# Altium project 2CH_PM_Simulator.PrjPCB (part 3 of 3)

## Sheet SPI_MUX.SchDoc: Title
size 420 x 297 mm; Author: G.Kasprowicz; CompanyName: WUT ISE; DrawnBy: G.Kasprowicz; Organization: WUT ISE; Address1: PW ISE; Address2: Nowowiejska 15/19 00-665 Warsaw; Address3: gkasprow@gmail.com; Revision: 2; SheetNumber: -; SheetTotal: -; ModifiedBy: -; CheckedDate: -; Title2: Title 2; DivGrp: WUT ISE; Designer: G.Kasprowicz; ModifiedDate: -; ProjectName: Sensor Box
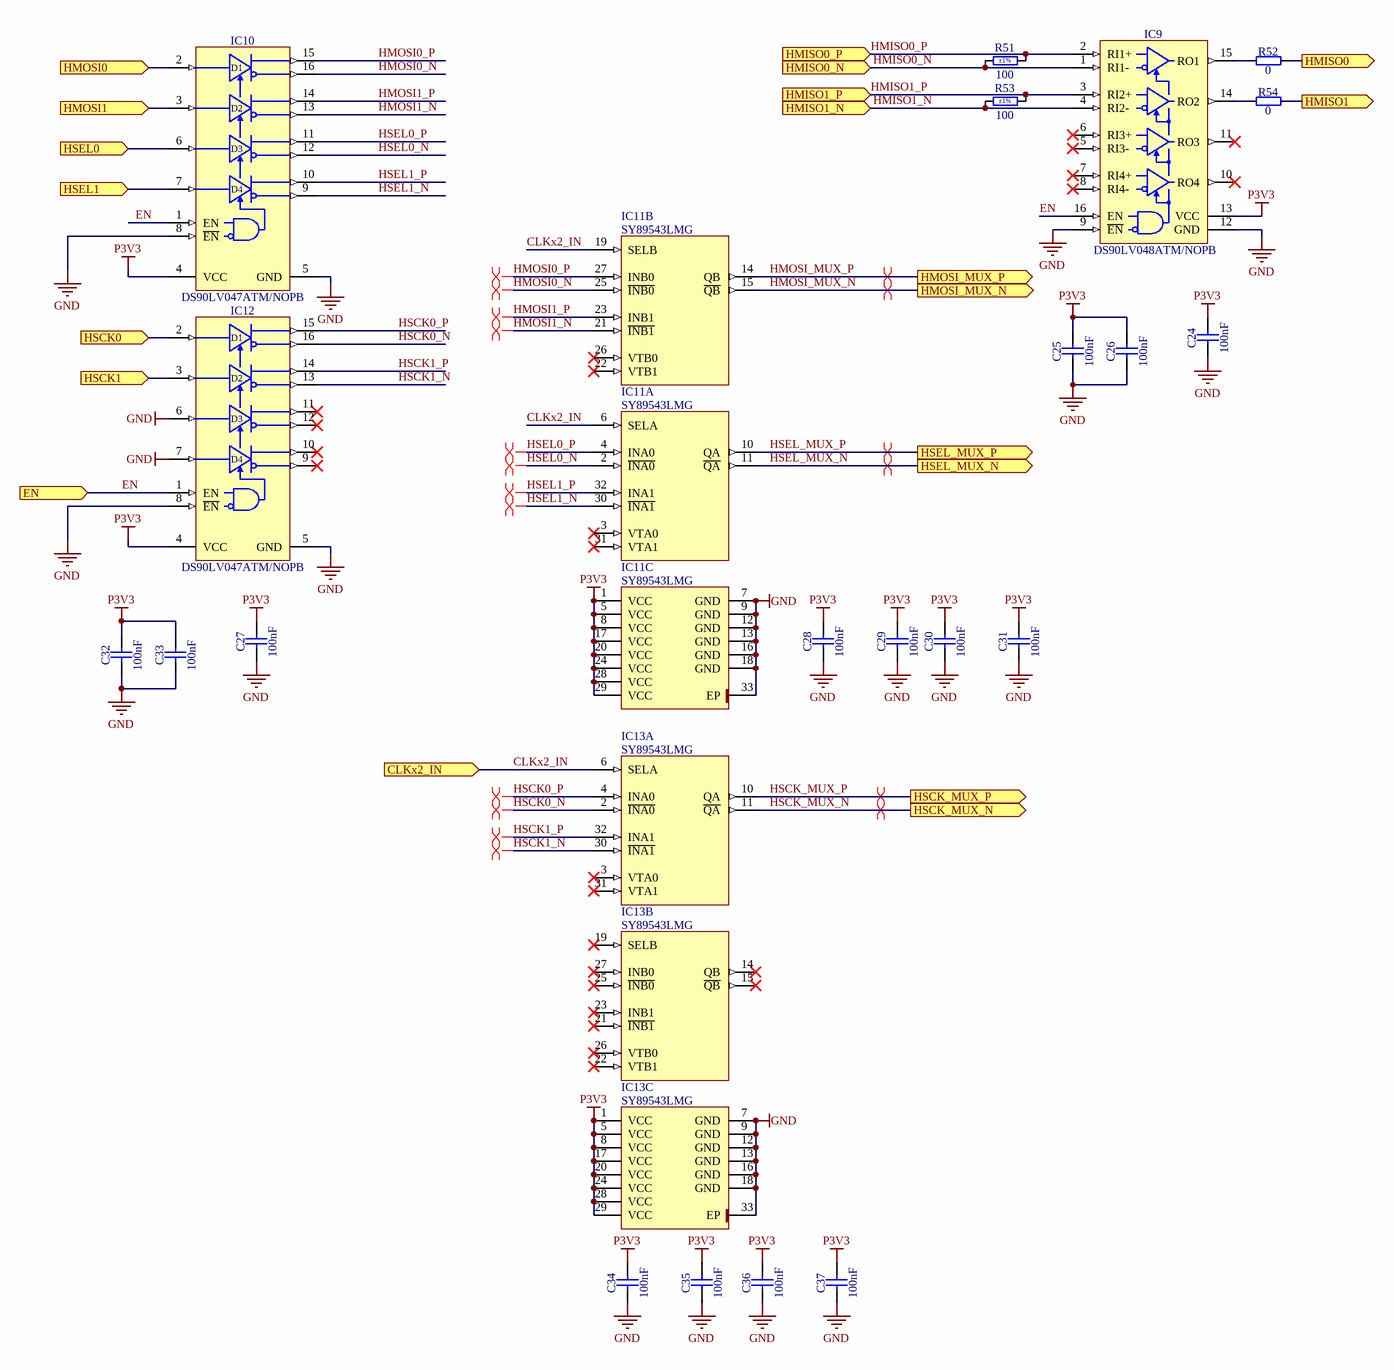
[diagram p6: SPI_MUX.SchDoc]

### Parts
C24  100nF  [CAPC1005X55N]
C25  100nF  [CAPC1005X55N]
C26  100nF  [CAPC1005X55N]
C27  100nF  [CAPC1005X55N]
C28  100nF  [CAPC1005X55N]
C29  100nF  [CAPC1005X55N]
C30  100nF  [CAPC1005X55N]
C31  100nF  [CAPC1005X55N]
C32  100nF  [CAPC1005X55N]
C33  100nF  [CAPC1005X55N]
C34  100nF  [CAPC1005X55N]
C35  100nF  [CAPC1005X55N]
C36  100nF  [CAPC1005X55N]
C37  100nF  [CAPC1005X55N]
IC9  DS90LV048ATM/NOPB  [SOIC127P600X175-16N]
IC10  DS90LV047ATM/NOPB  [SOIC127P600X175-16N]
IC11  SY89543LMG  [QFN50P500X500X90-33N-S320]  (parts A,B,C of 3)
IC12  DS90LV047ATM/NOPB  [SOIC127P600X175-16N]
IC13  SY89543LMG  [QFN50P500X500X90-33N-S320]  (parts A,B,C of 3)
R51  100  Tolerance: ±1%  [RESC1005X40N]
R52  0  [RESC1005X40N]
R53  100  Tolerance: ±1%  [RESC1005X40N]
R54  0  [RESC1005X40N]

### Ports
CLKx2_IN (in), EN (in), HMISO0 (out), HMISO0_N (in), HMISO0_P (in), HMISO1 (out), HMISO1_N (in), HMISO1_P (in), HMOSI0 (in), HMOSI1 (in), HMOSI_MUX_N (out), HMOSI_MUX_P (out), HSCK0 (in), HSCK1 (in), HSCK_MUX_N (out), HSCK_MUX_P (out), HSEL0 (in), HSEL1 (in), HSEL_MUX_N (out), HSEL_MUX_P (out)

### Nets
GND: C24.1 C25.1 C26.1 C27.1 C28.1 C29.1 C30.1 C31.1 C32.1 C33.1 C34.1 C35.1 C36.1 C37.1 IC9.9(~{EN}) IC9.12(GND) IC10.5(GND) IC10.8(~{EN}) IC11.7(GND) IC11.9(GND) IC11.12(GND) IC11.13(GND) IC11.16(GND) IC11.18(GND) IC11.33(EP) IC12.5(GND) IC12.6(DIN3) IC12.7(DIN4) IC12.8(~{EN}) IC13.7(GND) IC13.9(GND) IC13.12(GND) IC13.13(GND) IC13.16(GND) IC13.18(GND) IC13.33(EP)
P3V3: C24.2 C25.2 C26.2 C27.2 C28.2 C29.2 C30.2 C31.2 C32.2 C33.2 C34.2 C35.2 C36.2 C37.2 IC9.13(VCC) IC10.4(VCC) IC11.1(VCC) IC11.5(VCC) IC11.8(VCC) IC11.17(VCC) IC11.20(VCC) IC11.24(VCC) IC11.28(VCC) IC11.29(VCC) IC12.4(VCC) IC13.1(VCC) IC13.5(VCC) IC13.8(VCC) IC13.17(VCC) IC13.20(VCC) IC13.24(VCC) IC13.28(VCC) IC13.29(VCC)
CLKx2_IN: IC11.6(SELA) IC11.19(SELB) IC13.6(SELA) ; port CLKx2_IN
EN: IC9.16(EN) IC10.1(EN) IC12.1(EN) ; port EN
HMISO: R52.2 ; port HMISO0
HMISO: R54.2 ; port HMISO1  [a separate net that carries the same name]
HMISO0_N: IC9.1(RI1-) R51.1 ; port HMISO0_N  [project net EEM_IO.LVDS_N13]
HMISO0_P: IC9.2(RI1+) R51.2 ; port HMISO0_P  [project net EEM_IO.LVDS_P13]
HMISO1_N: IC9.4(RI2-) R53.1 ; port HMISO1_N  [project net EEM_IO.LVDS_N14]
HMISO1_P: IC9.3(RI2+) R53.2 ; port HMISO1_P  [project net EEM_IO.LVDS_P14]
HMOSI: IC10.2(DIN1) ; port HMOSI0
HMOSI: IC10.3(DIN2) ; port HMOSI1  [a separate net that carries the same name]
HMOSI0_N: IC10.16(DOUT1-) IC11.25(~{INB0})
HMOSI0_P: IC10.15(DOUT1+) IC11.27(INB0)
HMOSI1_N: IC10.13(DOUT2-) IC11.21(~{INB1})
HMOSI1_P: IC10.14(DOUT2+) IC11.23(INB1)
HMOSI_MUX_N: IC11.15(~{QB}) ; port HMOSI_MUX_N  [project net EEM_IO.LVDS_N6]
HMOSI_MUX_P: IC11.14(QB) ; port HMOSI_MUX_P  [project net EEM_IO.LVDS_P6]
HSCK: IC12.2(DIN1) ; port HSCK0
HSCK: IC12.3(DIN2) ; port HSCK1  [a separate net that carries the same name]
HSCK0_N: IC12.16(DOUT1-) IC13.2(~{INA0})
HSCK0_P: IC12.15(DOUT1+) IC13.4(INA0)
HSCK1_N: IC12.13(DOUT2-) IC13.30(~{INA1})
HSCK1_P: IC12.14(DOUT2+) IC13.32(INA1)
HSCK_MUX_N: IC13.11(~{QA}) ; port HSCK_MUX_N  [project net EEM_IO.LVDS_N5]
HSCK_MUX_P: IC13.10(QA) ; port HSCK_MUX_P  [project net EEM_IO.LVDS_P5]
HSEL: IC10.6(DIN3) ; port HSEL0
HSEL: IC10.7(DIN4) ; port HSEL1  [a separate net that carries the same name]
HSEL0_N: IC10.12(DOUT3-) IC11.2(~{INA0})
HSEL0_P: IC10.11(DOUT3+) IC11.4(INA0)
HSEL1_N: IC10.9(DOUT4-) IC11.30(~{INA1})
HSEL1_P: IC10.10(DOUT4+) IC11.32(INA1)
HSEL_MUX_N: IC11.11(~{QA}) ; port HSEL_MUX_N  [project net EEM_IO.LVDS_N7]
HSEL_MUX_P: IC11.10(QA) ; port HSEL_MUX_P  [project net EEM_IO.LVDS_P7]
NetIC9_14: IC9.14(RO2) R54.1
NetIC9_15: IC9.15(RO1) R52.1

Not connected (* = marked no-connect by the designer): IC9 5(RI3-)* 6(RI3+)* 7(RI4+)* 8(RI4-)* 10(RO4)* 11(RO3)*; IC11 3(VTA0)* 22(VTB1)* 26(VTB0)* 31(VTA1)*; IC12 9(DOUT4-)* 10(DOUT4+)* 11(DOUT3+)* 12(DOUT3-)*; IC13 3(VTA0)* 14(QB)* 15(~{QB})* 19(SELB)* 21(~{INB1})* 22(VTB1)* 23(INB1)* 25(~{INB0})* 26(VTB0)* 27(INB0)* 31(VTA1)*

### Layout directives
differential pair: EEM_IO.LVDS_N5, EEM_IO.LVDS_N6, EEM_IO.LVDS_N7, EEM_IO.LVDS_P5, EEM_IO.LVDS_P6, EEM_IO.LVDS_P7, HMOSI0_N, HMOSI0_P, HMOSI1_N, HMOSI1_P, HSCK0_N, HSCK0_P, HSCK1_N, HSCK1_P, HSEL0_N, HSEL0_P, HSEL1_N, HSEL1_P

### Notes on the sheet
- Project/Equipment
- Document
- Designer
- Drawn by
- Check.by
- Copyright WUT ISE 2024.
  This documentation describes Open Hardware and is licensed under the CERN OHL v.2. You may redistribute and modify this documentation under the terms of the CERN OHL v.2. (http://ohwr.org/CERNOHL). This documentation is distributed WITHOUT ANY EXPRESS OR IMPLIED WARRANTY, INCLUDING OF MERCHANTABILITY, SATISFACTORY QUALITY AND FITNESS FOR A PARTICULAR PURPOSE. Please see the CERN OHL v.2 for applicable conditions.
- Contact
- File
- Last Mod.
- Print Date
- Sheet
- Size
- A3
- of
- Rev
- (in symbol DS90LV047ATM/NOPB) D1; D2; D3; D4

### Library data of the parts
C24-C37 = CC0402_100NF_50V_10%_X7R: Non-polarised capacitor; Part Description: SMD Multilayer Chip Ceramic Capacitor; Manufacturer: GENERIC; Manufacturer1 Part Number: GRM155R71H104KE14D; Voltage: 50V; TC: X7R; Tolerance: ±10%; Part Number: CC0402_100NF_50V_10%_X7R; Component Kind: Standard; Component Type: Standard; Pin Count: 2; Value: 100nF; Status: None; Manufacturer Part Number: CC0402_100NF_50V_10%_X7R; Case: 0402; Mounted: Yes; Socket: No; SMD: Yes; Sense: No; Manufacturer1 Example: MURATA; Manufacturer1 ComponentHeight: 0.55mm; HelpURL: \\cern.ch\dfs\Applications\Altium\Datasheets\CC0402_MURATA_GRM155R71H104KE14D.pdf; Author: CERN DEM MR; CreateDate: 30.06.2017; LatestRevisionDate: 30.06.2017
IC9 = DS90LV048ATM/NOPB: 3V LVDS Quad CMOS Differential Line Receiver; Manufacturer: TEXAS INSTRUMENTS; PressFit: No; Bonding: No; Part Number: DS90LV048ATM/NOPB; Component Kind: Standard; Component Type: Standard; Device: DS90LV048ATM/NOPB; PackageDescription: SOIC 16, Pitch 1.27mm - Body 4x10mm, IPC Medium Density; Part Description: 3V LVDS Quad CMOS Differential Line Receiver; Manufacturer Part Number: DS90LV048ATM; Pin Count: 16; Case: SOIC16; Mounted: Yes; Socket: No; SMD: Yes; Sense: No; ComponentHeight: 1.75mm; Author: CERN DEM JLC; HelpURL: \\cern.ch\dfs\Applications\Altium\Datasheets\DS90LV048ATM-NOPB.pdf; CreateDate: 10.03.2014; LatestRevisionDate: 01.06.2022
IC10 IC12 = DS90LV047ATM/NOPB: 3V LVDS Quad CMOS Differential Line Driver; Manufacturer: TEXAS INSTRUMENTS; PressFit: No; Bonding: No; Part Number: DS90LV047ATM/NOPB; Component Kind: Standard; Component Type: Standard; Device: DS90LV047ATM/NOPB; PackageDescription: SOIC 16, Pitch 1.27mm - Body 4x10mm, IPC Medium Density; Part Description: 3V LVDS Quad CMOS Differential Line Driver; Manufacturer Part Number: DS90LV047ATM; Pin Count: 16; Case: SOIC16; Mounted: Yes; Socket: No; SMD: Yes; Sense: No; ComponentHeight: 1.75mm; Author: CERN DEM JLC; HelpURL: \\cern.ch\dfs\Applications\Altium\Datasheets\DS90LV047ATM-NOPB.pdf; CreateDate: 02.07.2014; LatestRevisionDate: 01.06.2022
IC11 IC13 = SY89543LMG: 3.3V, 3.2Gbps Dual, Differential 2:1 LVDS Multiplexer With Internal Termination; Manufacturer: MICREL; PressFit: No; Bonding: No; Part Number: SY89543LMG; Component Kind: Standard; Component Type: Standard; Device: SY89543LMG; PackageDescription: QFN, (MO-220-VHHD-4) 0.50mm Pitch, Square; 32 Pin, 5.00mm L X 5.00mm W X 0.9mm H body (w/Thermal Tab 3.20 X 3.20mm), IPC Medium Density; Part Description: 3.3V, 3.2Gbps Dual, Differential 2:1 LVDS Multiplexer with Internal Termination; Manufacturer Part Number: SY89543LMG; Pin Count: 33; Case: QFN32; Mounted: Yes; Socket: No; SMD: Yes; Sense: No; ComponentHeight: 0.9mm; Author: CERN DEM JLC; HelpURL: \\cern.ch\dfs\Applications\Altium\Datasheets\SY89543LMG.pdf; CreateDate: 05.12.2011; LatestRevisionDate: 21.12.2011
R51 R53 = R0402_100R_1%_0.0625W_100PPM: Resistor - 1%; Part Description: General Purpose Thick Film Chip Resistor; Manufacturer: GENERIC; Manufacturer1 Part Number: 232270671001L; TC: ±100ppm/°C; PressFit: No; Part Number: R0402_100R_1%_0.0625W_100PPM; Component Kind: Standard; Component Type: Standard; Pin Count: 2; Value: 100; Status: Not Recommended; Power: 0.0625W; Manufacturer Part Number: R0402_100R_1%_0.0625W_100PPM; Case: 0402; Mounted: Yes; Sense: No; Socket: No; SMD: Yes; Manufacturer1 Example: YAGEO PHYCOMP; Manufacturer1 ComponentHeight: 0.4mm; HelpURL: \\cern.ch\dfs\Applications\Altium\Datasheets\R0402_Phycomp_RC0402.pdf; Author: CERN DEM JLC; CreateDate: 03.12.2007; LatestRevisionDate: 17.10.2012
R52 R54 = R0402_0R_JUMPER: Resistor; Part Description: 1A (0.05R Max DC Resistance) Zero Ohm Jumper; Manufacturer: GENERIC; Manufacturer1 Part Number: 232270591001L; PressFit: No; Part Number: R0402_0R_JUMPER; Component Kind: Standard; Component Type: Standard; Pin Count: 2; Value: 0; Status: Not Recommended; Manufacturer Part Number: R0402_0R_JUMPER; Case: 0402; Mounted: Yes; Sense: No; Socket: No; SMD: Yes; Manufacturer1 Example: YAGEO PHYCOMP; Manufacturer1 ComponentHeight: 0.4mm; HelpURL: \\cern.ch\dfs\Applications\Altium\Datasheets\R0402_Phycomp_RC0402.pdf; Author: CERN DEM JLC; CreateDate: 03.12.2007; LatestRevisionDate: 17.10.2012

## Sheet CLK_GEN.SchDoc: Title
size 420 x 297 mm; Author: G.Kasprowicz; CompanyName: WUT ISE; DrawnBy: G.Kasprowicz; Organization: WUT ISE; Address1: PW ISE; Address2: Nowowiejska 15/19 00-665 Warsaw; Address3: gkasprow@gmail.com; Revision: 2; SheetNumber: -; SheetTotal: -; ModifiedBy: -; CheckedDate: -; Title2: Title 2; DivGrp: WUT ISE; Designer: G.Kasprowicz; ModifiedDate: -; ProjectName: Sensor Box
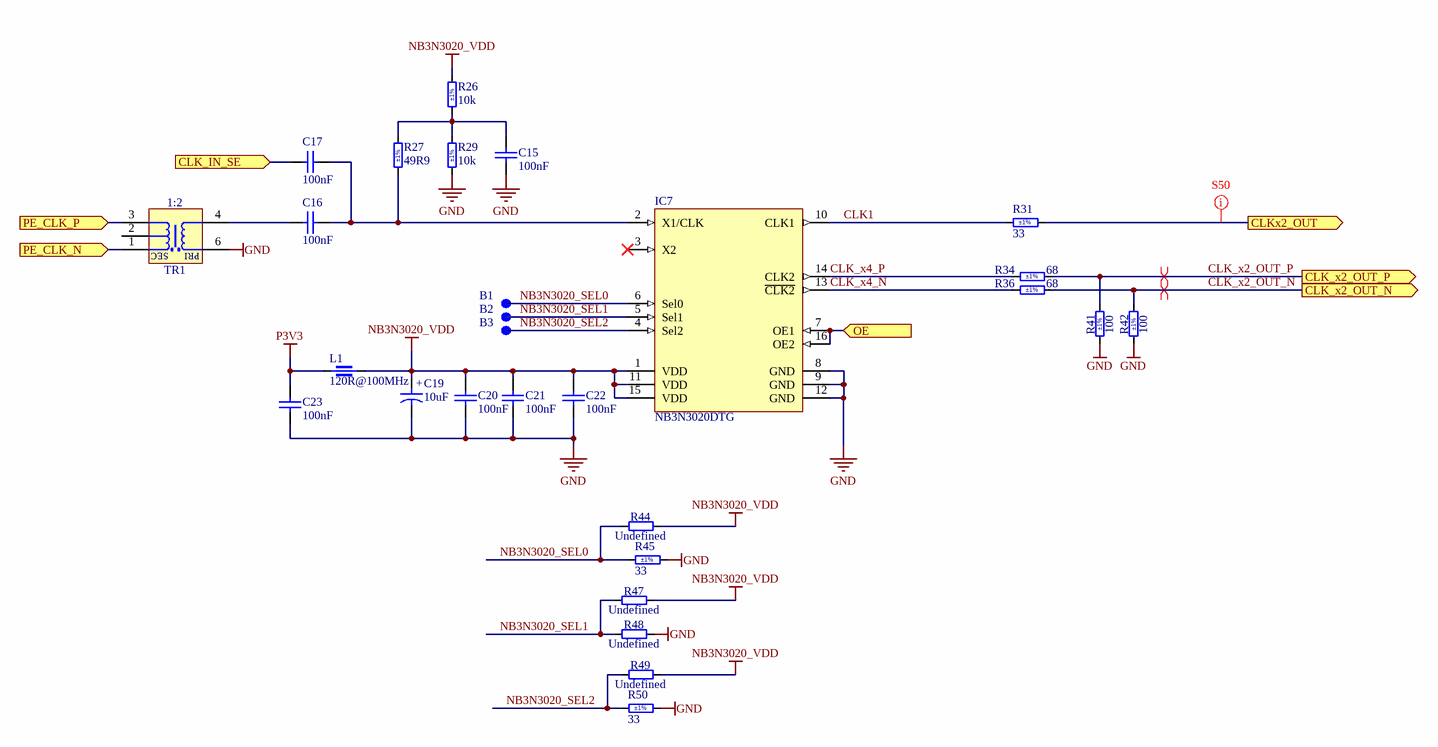
[diagram p7: CLK_GEN.SchDoc]

### Parts
B1  SMD Pad  [C100]  (value not drawn)  (no BOM)
B2  SMD Pad  [C100]  (value not drawn)  (no BOM)
B3  SMD Pad  [C100]  (value not drawn)  (no BOM)
C15  100nF  [CAPC1005X55N]
C16  100nF  [CAPC1005X55N]
C17  100nF  [CAPC1005X55N]
C19  10uF  [CAPMP3216X180N]
C20  100nF  [CAPC1005X55N]
C21  100nF  [CAPC1005X55N]
C22  100nF  [CAPC1005X55N]
C23  100nF  [CAPC1005X55N]
IC7  NB3N3020DTG  [TSOP65P640X120-16N]
L1  120R@100MHz  [INDC1608X65N]
R26  10k  Tolerance: ±1%  [RESC1608X55N]
R27  49R9  Tolerance: ±1%  [RESC1005X40N]
R29  10k  Tolerance: ±1%  [RESC1608X55N]
R31  33  Tolerance: ±1%  [RESC1005X40N]
R34  68  Tolerance: ±1%  [RESC1005X40N]
R36  68  Tolerance: ±1%  [RESC1005X40N]
R41  100  Tolerance: ±1%  [RESC1005X40N]
R42  100  Tolerance: ±1%  [RESC1005X40N]
R44  Undefined  [RESC1608X55N]
R45  33  Tolerance: ±1%  [RESC1005X40N]
R47  Undefined  [RESC1608X55N]
R48  Undefined  [RESC1608X55N]
R49  Undefined  [RESC1608X55N]
R50  33  Tolerance: ±1%  [RESC1005X40N]
TR1  1:2  [XFMR_MINI-CIRCUITS_DB714]

### Ports
CLK_IN_SE (in), CLK_x2_OUT_N (out), CLK_x2_OUT_P (out), CLKx2_OUT (out), OE (in), PE_CLK_N (in), PE_CLK_P (in)

### Nets
GND: C15.1 C19.2 C20.1 C21.1 C22.1 C23.1 IC7.8(GND) IC7.9(GND) IC7.12(GND) R29.1 R41.1 R42.1 R45.2 R48.2 R50.2 TR1.6(PDOT)
NB3N3020_VDD: C19.1 C20.2 C21.2 C22.2 IC7.1(VDD) IC7.11(VDD) IC7.15(VDD) L1.2 R26.2 R44.2 R47.2 R49.2
P3V3: C23.2 L1.1
CLK1: IC7.10(CLK1) R31.1
CLK_x2_OUT_N: R36.2 R42.2 ; port CLK_x2_OUT_N
CLK_x2_OUT_P: R34.2 R41.2 ; port CLK_x2_OUT_P
CLK_x4_N: IC7.13(~{CLK2}) R36.1
CLK_x4_P: IC7.14(CLK2) R34.1
CLKx2_IN: R31.2 ; port CLKx2_OUT
NB3N3020_SEL0: B1.1 IC7.6(Sel0) R44.1 R45.1
NB3N3020_SEL1: B2.1 IC7.5(Sel1) R47.1 R48.1
NB3N3020_SEL2: B3.1 IC7.4(Sel2) R49.1 R50.1
PE_CLK.CLK_N: TR1.1(SDOT) ; port PE_CLK_N
PE_CLK.CLK_P: TR1.3(S) ; port PE_CLK_P
NetC15_2: C15.2 R26.1 R27.2 R29.2
NetC16_1: C16.1 TR1.4(P)
NetC16_2: C16.2 C17.2 IC7.2(X1/CLK) R27.1
NetC17_1: C17.1 ; port CLK_IN_SE
NetIC7_7: IC7.7(OE1) IC7.16(OE2) ; port OE

Not connected (* = marked no-connect by the designer): IC7 3(X2)*; TR1 2(NU)

### Layout directives
net class S50: CLKx2_IN
differential pair: CLK_x2_OUT_N, CLK_x2_OUT_P

### Notes on the sheet
- Project/Equipment
- Document
- Designer
- Drawn by
- Check.by
- Copyright WUT ISE 2024.
  This documentation describes Open Hardware and is licensed under the CERN OHL v.2. You may redistribute and modify this documentation under the terms of the CERN OHL v.2. (http://ohwr.org/CERNOHL). This documentation is distributed WITHOUT ANY EXPRESS OR IMPLIED WARRANTY, INCLUDING OF MERCHANTABILITY, SATISFACTORY QUALITY AND FITNESS FOR A PARTICULAR PURPOSE. Please see the CERN OHL v.2 for applicable conditions.
- Contact
- File
- Last Mod.
- Print Date
- Sheet
- Size
- A3
- of
- Rev
- (in symbol CTE3216-18_10UF_16V_20%_AVX_TCJ) +
- (in symbol XFMR_MINI-CIRCUITS_TCM2-1T) SEC; PRI

### Library data of the parts
B1-B3 = SMD_PAD_D1MM: Pad; Part Description: 1mm Diameter SMD Pad; Mounted: No; Part Number: SMD_PAD_D1MM; Component Type: Standard (No BOM); Pin Count: 1; Family: SMD Pad; Socket: No; SMD: Yes; Sense: No; Status: None; ComponentHeight: 0mm; HelpURL: Undefined; Author: CERN DEM JLC; CreateDate: 10/10/2017; LatestRevisionDate: 10/10/2017; PackageDescription: 1mm Diameter SMD Pad
C15-C17 C20-C23 = CC0402_100NF_50V_10%_X7R: as C24-C37 on sheet SPI_MUX; Part Number: CC0402_100NF_50V_10%_X7R; Component Kind: Standard; Component Type: Standard; Pin Count: 2; Value: 100nF; Status: None; Manufacturer Part Number: CC0402_100NF_50V_10%_X7R; Case: 0402; Mounted: Yes; Socket: No; SMD: Yes; Sense: No; Manufacturer1 Example: MURATA; Manufacturer1 ComponentHeight: 0.55mm; HelpURL: \\cern.ch\dfs\Applications\Altium\Datasheets\CC0402_MURATA_GRM155R71H104KE14D.pdf; Author: CERN DEM MR; CreateDate: 6/30/2017; LatestRevisionDate: 6/30/2017
C19 = CTE3216-18_10UF_16V_20%_AVX_TCJ: Polarised capacitor; Part Description: ESR 0R200 Tantalum Solid Electrolytic Chip Capacitor with Conductive Polymer Electrode; Manufacturer: AVX; Manufacturer Part Number: TCJA106M016R0200; Voltage: 16V; Tolerance: ±20%; Part Number: CTE3216-18_10UF_16V_20%_AVX_TCJ; Component Kind: Standard; Component Type: Standard; Pin Count: 2; Value: 10uF; Status: Preferred; Case: A; Mounted: Yes; Socket: No; SMD: Yes; Sense: No; ComponentHeight: 1.8mm; HelpURL: \\cern.ch\dfs\Applications\Altium\Datasheets\CTE_AVX_TCJ.pdf; Author: CERN DEM JLC; CreateDate: 3/29/2012; LatestRevisionDate: 3/29/2012
IC7 = NB3N3020DTG: Clock Generator 2MHz to 210MHz Input 210MHz Output 16-Pin TSSOP Tube; Manufacturer: ON Semiconductor; Supplier: Digikey; Supplier Part Number: NB3N3020DTGOS-ND; Manufacturer Part Number: NB3N3020DTG; RoHS: Yes; Category: Clock Generators, PLLs, Frequency Synthesizers; Stock: 1304; Pricing: 1=10.69, 10=9.654, 96=7.9925, 288=7.63326, 576=6.95974, 1056=6.06171 (USD); ComponentLink1URL: https://datasheet.ciiva.com/12072/nb3n3020-d-112477-12072970.pdf?src-supplier=Mouser; ComponentLink1Description: https://datasheet.ciiva.com/12072/nb3n3020-d-112477-12072970.pdf?src-supplier=Mouser; ComponentLink2URL: https://datasheet.ciiva.com/15153/getdatasheetpartid-556163-15153893.pdf?src-supplier=Verical; ComponentLink2Description: https://datasheet.ciiva.com/15153/getdatasheetpartid-556163-15153893.pdf?src-supplier=Verical
L1 = IND0603_MURATA_BLM18SG121TN1D: Part Description: SMD EMIFIL Suppression Chip Ferrite Bead; Manufacturer: MURATA; Power: 3A; Resistance: 0.025R; Tolerance: ±25%; Part Number: IND0603_MURATA_BLM18SG121TN1D; Component Kind: Standard; Component Type: Standard; Pin Count: 2; Value: 120R@100MHz; Manufacturer Part Number: BLM18SG121TN1D; Case: 0603; Mounted: Yes; Socket: No; SMD: Yes; Sense: No; ComponentHeight: 0.65mm; HelpURL: \\cern.ch\dfs\Applications\Altium\Datasheets\IND0603_MURATA_BLM18S.pdf; Author: CERN DEM JLC; CreateDate: 7/23/2014; LatestRevisionDate: 10/25/2018
R26 R29 = R0603_10K_1%_0.1W_100PPM: Resistor - 1%; Part Description: General Purpose Thick Film Chip Resistor; Manufacturer: GENERIC; Manufacturer1 Part Number: NRC06F1002TRF; Power: 0.1W; TC: ±100ppm/°C; PressFit: No; Part Number: R0603_10K_1%_0.1W_100PPM; Component Kind: Standard; Component Type: Standard; Pin Count: 2; Value: 10k; Status: Preferred; Manufacturer Part Number: R0603_10K_1%_0.1W_100PPM; Case: 0603; Mounted: Yes; Sense: No; Socket: No; SMD: Yes; Manufacturer1 Example: NIC COMPONENT; Manufacturer1 ComponentHeight: 0.55mm; HelpURL: \\cern.ch\dfs\Applications\Altium\Datasheets\R0603_NIC_NRC.pdf; Author: CERN DEM JLC; CreateDate: 03.12.2007; LatestRevisionDate: 13.03.2008
R27 = R0402_49R9_1%_0.0625W_100PPM: Resistor - 1%; Part Description: General Purpose Thick Film Chip Resistor; Manufacturer: GENERIC; Manufacturer1 Part Number: 232270674999L or RC0402FR-0749R9L; TC: ±100ppm/°C; PressFit: No; Part Number: R0402_49R9_1%_0.0625W_100PPM; Component Kind: Standard; Component Type: Standard; Pin Count: 2; Value: 49R9; Status: Not Recommended; Power: 0.0625W; Manufacturer Part Number: R0402_49R9_1%_0.0625W_100PPM; Case: 0402; Mounted: Yes; Sense: No; Socket: No; SMD: Yes; Manufacturer1 Example: YAGEO PHYCOMP; Manufacturer1 ComponentHeight: 0.4mm; HelpURL: \\cern.ch\dfs\Applications\Altium\Datasheets\R0402_Phycomp_RC0402.pdf; Author: CERN DEM JLC; CreateDate: 10/24/2012; LatestRevisionDate: 10/24/2012
R31 R45 R50 = R0402_33R_1%_0.0625W_100PPM: Resistor - 1%; Part Description: General Purpose Thick Film Chip Resistor; Manufacturer: GENERIC; Manufacturer1 Part Number: 232270673309L; TC: ±100ppm/°C; PressFit: No; Part Number: R0402_33R_1%_0.0625W_100PPM; Component Kind: Standard; Component Type: Standard; Pin Count: 2; Value: 33; Status: Not Recommended; Power: 0.0625W; Manufacturer Part Number: R0402_33R_1%_0.0625W_100PPM; Case: 0402; Mounted: Yes; Sense: No; Socket: No; SMD: Yes; Manufacturer1 Example: YAGEO PHYCOMP; Manufacturer1 ComponentHeight: 0.4mm; HelpURL: \\cern.ch\dfs\Applications\Altium\Datasheets\R0402_Phycomp_RC0402.pdf; Author: CERN DEM JLC; CreateDate: 12/3/2007; LatestRevisionDate: 10/17/2012
R34 R36 = R0402_68R_1%_0.0625W_100PPM: Resistor - 1%; Part Description: General Purpose Thick Film Chip Resistor; Manufacturer: GENERIC; Manufacturer1 Part Number: 232270676809L; TC: ±100ppm/°C; PressFit: No; Part Number: R0402_68R_1%_0.0625W_100PPM; Component Kind: Standard; Component Type: Standard; Pin Count: 2; Value: 68; Status: Not Recommended; Power: 0.0625W; Manufacturer Part Number: R0402_68R_1%_0.0625W_100PPM; Case: 0402; Mounted: Yes; Sense: No; Socket: No; SMD: Yes; Manufacturer1 Example: YAGEO PHYCOMP; Manufacturer1 ComponentHeight: 0.4mm; HelpURL: \\cern.ch\dfs\Applications\Altium\Datasheets\R0402_Phycomp_RC0402.pdf; Author: CERN DEM JLC; CreateDate: 03.12.2007; LatestRevisionDate: 17.10.2012
R41 R42 = R0402_100R_1%_0.0625W_100PPM: as R51 on sheet SPI_MUX; Part Number: R0402_100R_1%_0.0625W_100PPM; Component Kind: Standard; Component Type: Standard; Pin Count: 2; Value: 100; Status: Not Recommended; Power: 0.0625W; Manufacturer Part Number: R0402_100R_1%_0.0625W_100PPM; Case: 0402; Mounted: Yes; Sense: No; Socket: No; SMD: Yes; Manufacturer1 Example: YAGEO PHYCOMP; Manufacturer1 ComponentHeight: 0.4mm; HelpURL: \\cern.ch\dfs\Applications\Altium\Datasheets\R0402_Phycomp_RC0402.pdf; Author: CERN DEM JLC; CreateDate: 03.12.2007; LatestRevisionDate: 17.10.2012
R44 R47-R49 = R0603_NO-VALUE: Resistor; Part Description: Reserved Footprint For a 0603 (1608) Chip Resistor; PressFit: No; Mounted: No; Part Number: R0603_NO-VALUE; Component Kind: Standard; Component Type: Standard; Pin Count: 2; Value: Undefined; Status: None; Manufacturer: Undefined; Manufacturer Part Number: R0603_NO-VALUE; Case: 0603; Sense: No; Socket: No; SMD: Yes; Manufacturer1 Example: Undefined; Manufacturer1 Part Number: Undefined; Manufacturer1 ComponentHeight: Undefined; HelpURL: Undefined; Author: CERN DEM JLC; CreateDate: 03.12.2007; LatestRevisionDate: 13.03.2008
TR1 = XFMR_MINI-CIRCUITS_TCM2-1T: 50 Ohms 3 to 300MHz RF Transformer; Power: 0.25W; Part Number: XFMR_MINI-CIRCUITS_TCM2-1T; Component Kind: Standard; Component Type: Standard; Pin Count: 6; Value: 1:2; Status: None; Part Description: 50 Ohms 3 to 300MHz RF Transformer; Manufacturer: MINI-CIRCUITS; Manufacturer Part Number: TCM2-1T; Mounted: Yes; Socket: No; Sense: No; SMD: Yes; ComponentHeight: 4.06mm; HelpURL: \\cern.ch\dfs\Applications\Altium\Datasheets\XFMR_MINI-CIRCUITS_TCM2-1T.pdf; Author: CERN DEM HF; CreateDate: 30.05.2023; LatestRevisionDate: 30.05.2023

## Nets that join several sheets
GND: 2CH_PM_Simulator (9 pins), Power_Supplies (28 pins), CPCIS_Connectors_P1_P6 (66 pins), EEM_Connectors (35 pins), U_PM_HDMI_CON_0 (13 pins), U_Redriver_0 (10 pins), SPI_MUX (36 pins), U_PM_HDMI_CON_1 (13 pins), U_Redriver_1 (10 pins), CLK_GEN (16 pins)
P3V3: 2CH_PM_Simulator (R15.2 R16.2), Power_Supplies (6 pins), EEM_Connectors (C298.2 IC40.14), U_PM_HDMI_CON_0 (7 pins), U_Redriver_0 (12 pins), SPI_MUX (33 pins), U_PM_HDMI_CON_1 (7 pins), U_Redriver_1 (12 pins), CLK_GEN (C23.2 L1.1)
P3V3_DIOT: Power_Supplies (C102.1 D11.2 IC14.5), CPCIS_Connectors_P1_P6 (13 pins)
P3V3_MP: Power_Supplies (5 pins), EEM_Connectors (5 pins)
P12V0: Power_Supplies (10 pins), EEM_Connectors (8 pins)
P12V0_DIOT: Power_Supplies (C40.2 IC14.1 IC14.3), CPCIS_Connectors_P1_P6 (7 pins), EEM_Connectors (R257.1 R260.1 R261.1 R262.1)
BP_I2C.SCL: CPCIS_Connectors_P1_P6 (D5.3 J6.B2), EEM_Connectors (R77.1)
BP_I2C.SDA: CPCIS_Connectors_P1_P6 (D5.1 J6.C2), EEM_Connectors (R3.1)
BP_IO.LVDS_N0: CPCIS_Connectors_P1_P6 (J6.E3), EEM_Connectors (R161.1)
BP_IO.LVDS_N1: CPCIS_Connectors_P1_P6 (J6.B3), EEM_Connectors (R162.1)
BP_IO.LVDS_N2: CPCIS_Connectors_P1_P6 (J6.C4), EEM_Connectors (R163.1)
BP_IO.LVDS_N3: CPCIS_Connectors_P1_P6 (J6.L4), EEM_Connectors (R164.1)
BP_IO.LVDS_N4: CPCIS_Connectors_P1_P6 (J6.I4), EEM_Connectors (R167.1)
BP_IO.LVDS_N5: CPCIS_Connectors_P1_P6 (J6.K5), EEM_Connectors (R168.1)
BP_IO.LVDS_N6: CPCIS_Connectors_P1_P6 (J6.H5), EEM_Connectors (R169.1)
BP_IO.LVDS_N7: CPCIS_Connectors_P1_P6 (J6.F6), EEM_Connectors (R170.1)
BP_IO.LVDS_N8: CPCIS_Connectors_P1_P6 (J6.C6), EEM_Connectors (R171.1)
BP_IO.LVDS_N9: CPCIS_Connectors_P1_P6 (J6.L6), EEM_Connectors (R172.1)
BP_IO.LVDS_N10: CPCIS_Connectors_P1_P6 (J6.I6), EEM_Connectors (R173.1)
BP_IO.LVDS_N11: CPCIS_Connectors_P1_P6 (J7.E1), EEM_Connectors (R174.1)
BP_IO.LVDS_N12: CPCIS_Connectors_P1_P6 (J7.B1), EEM_Connectors (R175.1)
BP_IO.LVDS_N13: CPCIS_Connectors_P1_P6 (J7.K1), EEM_Connectors (R176.1)
BP_IO.LVDS_N14: CPCIS_Connectors_P1_P6 (J7.H1), EEM_Connectors (R177.1)
BP_IO.LVDS_N15: CPCIS_Connectors_P1_P6 (J6.F2), EEM_Connectors (R144.2)
BP_IO.LVDS_P0: CPCIS_Connectors_P1_P6 (J6.D3), EEM_Connectors (R145.1)
BP_IO.LVDS_P1: CPCIS_Connectors_P1_P6 (J6.A3), EEM_Connectors (R146.1)
BP_IO.LVDS_P2: CPCIS_Connectors_P1_P6 (J6.B4), EEM_Connectors (R147.1)
BP_IO.LVDS_P3: CPCIS_Connectors_P1_P6 (J6.K4), EEM_Connectors (R148.1)
BP_IO.LVDS_P4: CPCIS_Connectors_P1_P6 (J6.H4), EEM_Connectors (R149.1)
BP_IO.LVDS_P5: CPCIS_Connectors_P1_P6 (J6.J5), EEM_Connectors (R150.1)
BP_IO.LVDS_P6: CPCIS_Connectors_P1_P6 (J6.G5), EEM_Connectors (R151.1)
BP_IO.LVDS_P7: CPCIS_Connectors_P1_P6 (J6.E6), EEM_Connectors (R152.1)
BP_IO.LVDS_P8: CPCIS_Connectors_P1_P6 (J6.B6), EEM_Connectors (R5.1)
BP_IO.LVDS_P9: CPCIS_Connectors_P1_P6 (J6.K6), EEM_Connectors (R6.1)
BP_IO.LVDS_P10: CPCIS_Connectors_P1_P6 (J6.H6), EEM_Connectors (R7.1)
BP_IO.LVDS_P11: CPCIS_Connectors_P1_P6 (J7.D1), EEM_Connectors (R156.1)
BP_IO.LVDS_P12: CPCIS_Connectors_P1_P6 (J7.A1), EEM_Connectors (R157.1)
BP_IO.LVDS_P13: CPCIS_Connectors_P1_P6 (J7.J1), EEM_Connectors (R158.1)
BP_IO.LVDS_P14: CPCIS_Connectors_P1_P6 (J7.G1), EEM_Connectors (R159.1)
BP_IO.LVDS_P15: CPCIS_Connectors_P1_P6 (J6.E2), EEM_Connectors (R143.2)
CLK_x2_OUT_N: EEM_Connectors (J9.24 R144.1), CLK_GEN (R36.2 R42.2)
CLK_x2_OUT_P: EEM_Connectors (J9.23 R143.1), CLK_GEN (R34.2 R41.2)
CLKx2_IN: SPI_MUX (IC11.6 IC11.19 IC13.6), CLK_GEN (R31.2)
EEM0_I2C.SCL: Power_Supplies (IC33.2), EEM_Connectors (6 pins)
EEM0_I2C.SDA: Power_Supplies (IC33.1), EEM_Connectors (6 pins)
EEM_IO.LVDS_N0: EEM_Connectors (J8.3 R161.2), U_Redriver_0 (IC5A.5)
EEM_IO.LVDS_N1: EEM_Connectors (J8.6 R162.2), U_Redriver_0 (IC4A.5)
EEM_IO.LVDS_N2: EEM_Connectors (J8.9 R163.2), U_Redriver_0 (IC4A.2)
EEM_IO.LVDS_N3: EEM_Connectors (J8.12 R164.2), U_Redriver_0 (IC4A.7)
EEM_IO.LVDS_N4: EEM_Connectors (J8.15 R167.2), U_Redriver_0 (IC4A.10)
EEM_IO.LVDS_N5: EEM_Connectors (J8.18 R168.2), SPI_MUX (IC13.11)
EEM_IO.LVDS_N6: EEM_Connectors (J8.21 R169.2), SPI_MUX (IC11.15)
EEM_IO.LVDS_N7: EEM_Connectors (J8.24 R170.2), SPI_MUX (IC11.11)
EEM_IO.LVDS_N8: EEM_Connectors (J9.3 R171.2), U_Redriver_1 (IC5B.5)
EEM_IO.LVDS_N9: EEM_Connectors (J9.6 R172.2), U_Redriver_1 (IC4B.5)
EEM_IO.LVDS_N10: EEM_Connectors (J9.9 R173.2), U_Redriver_1 (IC4B.2)
EEM_IO.LVDS_N11: EEM_Connectors (J9.12 R174.2), U_Redriver_1 (IC4B.7)
EEM_IO.LVDS_N12: EEM_Connectors (J9.15 R175.2), U_Redriver_1 (IC4B.10)
EEM_IO.LVDS_N13: EEM_Connectors (J9.18 R176.2), SPI_MUX (IC9.1 R51.1)
EEM_IO.LVDS_N14: EEM_Connectors (J9.21 R177.2), SPI_MUX (IC9.4 R53.1)
EEM_IO.LVDS_P0: EEM_Connectors (J8.2 R145.2), U_Redriver_0 (IC5A.6)
EEM_IO.LVDS_P1: EEM_Connectors (J8.5 R146.2), U_Redriver_0 (IC4A.4)
EEM_IO.LVDS_P2: EEM_Connectors (J8.8 R147.2), U_Redriver_0 (IC4A.1)
EEM_IO.LVDS_P3: EEM_Connectors (J8.11 R148.2), U_Redriver_0 (IC4A.6)
EEM_IO.LVDS_P4: EEM_Connectors (J8.14 R149.2), U_Redriver_0 (IC4A.9)
EEM_IO.LVDS_P5: EEM_Connectors (J8.17 R150.2), SPI_MUX (IC13.10)
EEM_IO.LVDS_P6: EEM_Connectors (J8.20 R151.2), SPI_MUX (IC11.14)
EEM_IO.LVDS_P7: EEM_Connectors (J8.23 R152.2), SPI_MUX (IC11.10)
EEM_IO.LVDS_P8: EEM_Connectors (J9.2 R5.2), U_Redriver_1 (IC5B.6)
EEM_IO.LVDS_P9: EEM_Connectors (J9.5 R6.2), U_Redriver_1 (IC4B.4)
EEM_IO.LVDS_P10: EEM_Connectors (J9.8 R7.2), U_Redriver_1 (IC4B.1)
EEM_IO.LVDS_P11: EEM_Connectors (J9.11 R156.2), U_Redriver_1 (IC4B.6)
EEM_IO.LVDS_P12: EEM_Connectors (J9.14 R157.2), U_Redriver_1 (IC4B.9)
EEM_IO.LVDS_P13: EEM_Connectors (J9.17 R158.2), SPI_MUX (IC9.2 R51.2)
EEM_IO.LVDS_P14: EEM_Connectors (J9.20 R159.2), SPI_MUX (IC9.3 R53.2)
EN: 2CH_PM_Simulator (R56.2), SPI_MUX (IC9.16 IC10.1 IC12.1)
EQ: 2CH_PM_Simulator (R11.1), U_Redriver_0 (IC4A.11 IC4A.12 IC4A.39 IC4A.40), U_Redriver_1 (IC4B.11 IC4B.12 IC4B.39 IC4B.40)
HDMI_PM_DA0_N: U_PM_HDMI_CON_0 (J2A.12), U_Redriver_0 (IC4A.21)
HDMI_PM_DA0_N: U_PM_HDMI_CON_1 (J2B.12), U_Redriver_1 (IC4B.21)
HDMI_PM_DA0_P: U_PM_HDMI_CON_0 (J2A.10), U_Redriver_0 (IC4A.22)
HDMI_PM_DA0_P: U_PM_HDMI_CON_1 (J2B.10), U_Redriver_1 (IC4B.22)
HDMI_PM_DA1_N: U_PM_HDMI_CON_0 (J2A.9), U_Redriver_0 (IC4A.23)
HDMI_PM_DA1_N: U_PM_HDMI_CON_1 (J2B.9), U_Redriver_1 (IC4B.23)
HDMI_PM_DA1_P: U_PM_HDMI_CON_0 (J2A.7), U_Redriver_0 (IC4A.24)
HDMI_PM_DA1_P: U_PM_HDMI_CON_1 (J2B.7), U_Redriver_1 (IC4B.24)
HDMI_PM_DT0_N: U_PM_HDMI_CON_0 (J2A.6), U_Redriver_0 (IC4A.26)
HDMI_PM_DT0_N: U_PM_HDMI_CON_1 (J2B.6), U_Redriver_1 (IC4B.26)
HDMI_PM_DT0_P: U_PM_HDMI_CON_0 (J2A.4), U_Redriver_0 (IC4A.27)
HDMI_PM_DT0_P: U_PM_HDMI_CON_1 (J2B.4), U_Redriver_1 (IC4B.27)
HDMI_PM_DT1_N: U_PM_HDMI_CON_0 (J2A.3), U_Redriver_0 (IC4A.28)
HDMI_PM_DT1_N: U_PM_HDMI_CON_1 (J2B.3), U_Redriver_1 (IC4B.28)
HDMI_PM_DT1_P: U_PM_HDMI_CON_0 (J2A.1), U_Redriver_0 (IC4A.29)
HDMI_PM_DT1_P: U_PM_HDMI_CON_1 (J2B.1), U_Redriver_1 (IC4B.29)
HMISO: U_PM_HDMI_CON_0 (IC16A.2), SPI_MUX (R52.2)
HMISO: SPI_MUX (R54.2), U_PM_HDMI_CON_1 (IC16B.2)
HMOSI: U_PM_HDMI_CON_0 (IC15A.2), SPI_MUX (IC10.2)
HMOSI: SPI_MUX (IC10.3), U_PM_HDMI_CON_1 (IC15B.2)
HSCK: U_PM_HDMI_CON_0 (IC15A.5), SPI_MUX (IC12.2)
HSCK: SPI_MUX (IC12.3), U_PM_HDMI_CON_1 (IC15B.5)
HSEL: U_PM_HDMI_CON_0 (IC15A.7), SPI_MUX (IC10.6)
HSEL: SPI_MUX (IC10.7), U_PM_HDMI_CON_1 (IC15B.7)
NetC17_1: 2CH_PM_Simulator (J1.1), CLK_GEN (C17.1)
NetIC5A_3: 2CH_PM_Simulator (R9.1), U_Redriver_0 (IC5A.3)
NetIC5B_3: 2CH_PM_Simulator (R13.1), U_Redriver_1 (IC5B.3)
NetIC7_7: 2CH_PM_Simulator (R14.2), CLK_GEN (IC7.7 IC7.16)
nPWDN: 2CH_PM_Simulator (R8.1), U_Redriver_0 (5 pins)
nPWDN: 2CH_PM_Simulator (R12.1), U_Redriver_1 (5 pins)
PE: 2CH_PM_Simulator (R10.1), U_Redriver_0 (IC4A.18 IC4A.19 IC4A.20 IC4A.31), U_Redriver_1 (IC4B.18 IC4B.19 IC4B.20 IC4B.31)
PE_CLK.CLK_N: CPCIS_Connectors_P1_P6 (J6.F4), CLK_GEN (TR1.1)
PE_CLK.CLK_P: CPCIS_Connectors_P1_P6 (J6.E4), CLK_GEN (TR1.3)
PGOOD: 2CH_PM_Simulator (T6.1), Power_Supplies (IC1.7), CPCIS_Connectors_P1_P6 (R40.1 T2.1)
PSU_EN: Power_Supplies (IC1.8 R187.1 R188.2), CPCIS_Connectors_P1_P6 (R33.2)
SERVMOD_3V3: CPCIS_Connectors_P1_P6 (R55.2 R138.1), EEM_Connectors (IC40.5 IC40.6 IC40.12 IC40.13)
TCM_CLK_N: U_PM_HDMI_CON_0 (J2A.19), U_Redriver_0 (IC5A.1 R25A.1)
TCM_CLK_N: U_PM_HDMI_CON_1 (J2B.19), U_Redriver_1 (IC5B.1 R25B.1)
TCM_CLK_P: U_PM_HDMI_CON_0 (J2A.14), U_Redriver_0 (IC5A.8 R25A.2)
TCM_CLK_P: U_PM_HDMI_CON_1 (J2B.14), U_Redriver_1 (IC5B.8 R25B.2)

## Assembly variants
EEM: all parts fitted
DIOT: all parts fitted